# EAGLE schematic LED-Ring_ (EAGLE 9.7.0)
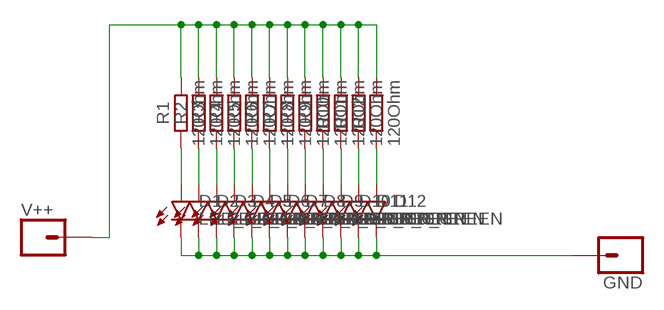
[diagram p0: schematic, sheet 1]

## Parts
D1  LED_GREEN  CHIP-ROUND-R_0805  [LEDC2012X105N_RND-R]
D2  LED_GREEN  CHIP-ROUND-R_0805  [LEDC2012X105N_RND-R]
D3  LED_GREEN  CHIP-ROUND-R_0805  [LEDC2012X105N_RND-R]
D4  LED_GREEN  CHIP-ROUND-R_0805  [LEDC2012X105N_RND-R]
D5  LED_GREEN  CHIP-ROUND-R_0805  [LEDC2012X105N_RND-R]
D6  LED_GREEN  CHIP-ROUND-R_0805  [LEDC2012X105N_RND-R]
D7  LED_GREEN  CHIP-ROUND-R_0805  [LEDC2012X105N_RND-R]
D8  LED_GREEN  CHIP-ROUND-R_0805  [LEDC2012X105N_RND-R]
D9  LED_GREEN  CHIP-ROUND-R_0805  [LEDC2012X105N_RND-R]
D10  LED_GREEN  CHIP-ROUND-R_0805  [LEDC2012X105N_RND-R]
D11  LED_GREEN  CHIP-ROUND-R_0805  [LEDC2012X105N_RND-R]
D12  LED_GREEN  CHIP-ROUND-R_0805  [LEDC2012X105N_RND-R]
GND  CONN_01PTH_2MM  [1X01_2MM]
R1  120Ohm  R_CHIP-1206(3216-METRIC)  [RESC3216X70]
R2  120Ohm  R_CHIP-1206(3216-METRIC)  [RESC3216X70]
R3  120Ohm  R_CHIP-1206(3216-METRIC)  [RESC3216X70]
R4  120Ohm  R_CHIP-1206(3216-METRIC)  [RESC3216X70]
R5  120Ohm  R_CHIP-1206(3216-METRIC)  [RESC3216X70]
R6  120Ohm  R_CHIP-1206(3216-METRIC)  [RESC3216X70]
R7  120Ohm  R_CHIP-1206(3216-METRIC)  [RESC3216X70]
R8  120Ohm  R_CHIP-1206(3216-METRIC)  [RESC3216X70]
R9  120Ohm  R_CHIP-1206(3216-METRIC)  [RESC3216X70]
R10  120Ohm  R_CHIP-1206(3216-METRIC)  [RESC3216X70]
R11  120Ohm  R_CHIP-1206(3216-METRIC)  [RESC3216X70]
R12  120Ohm  R_CHIP-1206(3216-METRIC)  [RESC3216X70]
V++  CONN_01PTH_2MM  [1X01_2MM]

## Nets
N$1: R1.2 R2.2 R3.2 R4.2 R5.2 R6.2 R7.2 R8.2 R9.2 R10.2 R11.2 R12.2 V++.1
N$2: D1.A R1.1
N$3: D2.A R2.1
N$4: D3.A R3.1
N$5: D4.A R4.1
N$6: D5.A R5.1
N$7: D6.A R6.1
N$8: D7.A R7.1
N$9: D8.A R8.1
N$10: D9.A R9.1
N$11: D10.A R10.1
N$12: D11.A R11.1
N$13: D12.A R12.1
N$14: D1.C D2.C D3.C D4.C D5.C D6.C D7.C D8.C D9.C D10.C D11.C D12.C GND.1

## Library data of the parts
D1-D12 = LED:CHIP-ROUND-R: LED - Generic; CATEGORY: LED; COLOR: RED; DESCRIPTION: CHIP LED ROUND; SUB-CATEGORY: CHIP; TYPE: ROUND_TOP; VALUE: LED_RED
GND V++ = SparkFun-Connectors:CONN_01: Single connection point. Often used as Generic Header-pin footprint for 0.1 inch spaced/style header connections On any of the 0.1 inch spaced packages, you can populate with these: Break Away Headers - Straight <https://www.sparkfun.com/products/116> (PRT-00116) Break Away Male Headers - Right Angle <https://www.sparkfun.com/products/553> (PRT-00553) Female Headers <https://www.sparkfun.com/products/115> (PRT-00115) Break Away Headers - Machine Pin <https://www.sparkfun.com/products/117> (PRT-00117) Break Away Female Headers - Swiss Machine Pin <https://www.sparkfun.com/products/743> (PRT-00743) This device is also useful as a general connection point to wire up your design to another part of your project. Our various solder wires solder well into these plated through hole pads. Hook-Up Wire - Assortment (Stranded, 22 AWG) <https://www.sparkfun.com/products/11375> (PRT-11375) Hook-Up Wire - Assortment (Solid Core, 22 AWG) <https://www.sparkfun.com/products/11367> (PRT-11367) View the entire wire category on our website here <https://www.sparkfun.com/categories/141> Special notes: SMTSO-256-ET is a "flush mount" nut for a 4-40 screw. We mostly use this on specialty testbeds; it is a nice way to connect hardware to your PCB at an adjustable hieght. Also note, the SNAP packages are for using a snappable style connector. We sell a baggie of snaps and they are also used on two LilyPad designs: Snap Assortment - 30 pack (male and female) <https://www.sparkfun.com/products/11347> (DEV-11347) LilyPad Arduino SimpleSnap <https://www.sparkfun.com/products/10941> (DEV-10941) LilyPad SimpleSnap Protoboard <https://www.sparkfun.com/products/10940> (DEV-10940)
R1-R12 = Resistor:R: Resistor Fixed - Generic; CATEGORY: Resistor; SUB-CATEGORY: Fixed